# Altium schematic sheet Deck.SchDoc: TOF_Deck
size A4; Author: Iman Ostovar; CompanyName: ETH Zürich; DrawnBy: Iman Ostovar; Engineer: Iman Ostovar; Organization: PBL; DocumentNumber: Master Project; Revision: A; SheetNumber: 1; SheetTotal: 1
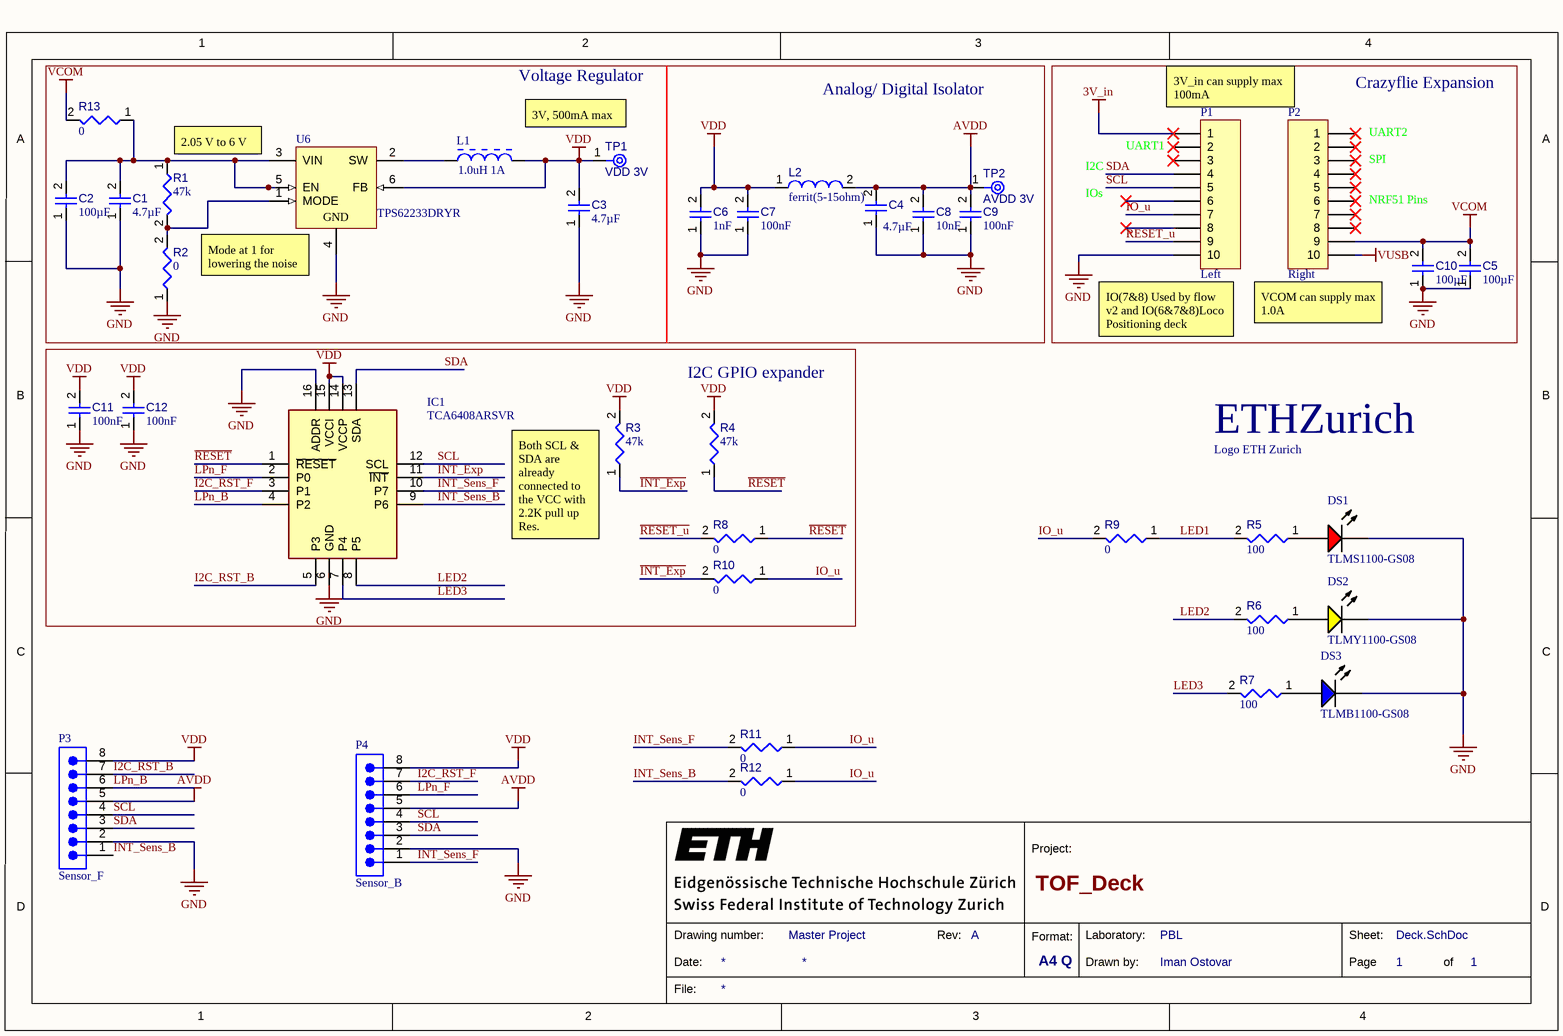
[diagram p0: Deck.SchDoc]

## Parts
A1  Logo ETH Zurich  [eth-zurich_3mm]  (no BOM)
C1  value 4.7µF  [CAPC1005X55X25ML5T10]  (hidden comment: Capacitor 1 uF +/- 10% 6.3 V 1005)
C2  value 100µF  [CAPC0805(2012)145_L]  (hidden comment: Capacitor 100µF +/-20% 6.3V 0805)
C3  value 4.7µF  [CAPC1005X55X25ML5T10]  (hidden comment: Capacitor 1 uF +/- 10% 6.3 V 1005)
C4  value 4.7µF  [CAPC1005X55X25ML5T10]  (hidden comment: Capacitor 1 uF +/- 10% 6.3 V 1005)
C5  value 100µF  [CAPC0805(2012)145_L]  (hidden comment: Capacitor 100µF +/-20% 6.3V 0805)
C6  value 1nF  [CAPC0402(1005)60_L]  (hidden comment: Capacitor 100nF +/-20% 25V 0402)
C7  value 100nF  [CAPC0402(1005)60_L]  (hidden comment: Capacitor 100nF +/-20% 25V 0402)
C8  value 10nF  [CAPC0402(1005)60_L]  (hidden comment: Capacitor 100nF +/-20% 25V 0402)
C9  value 100nF  [CAPC0402(1005)60_L]  (hidden comment: Capacitor 100nF +/-20% 25V 0402)
C10  value 100µF  [CAPC0805(2012)145_L]  (hidden comment: Capacitor 100µF +/-20% 6.3V 0805)
C11  value 100nF  [CAPC0402(1005)60_L]  (hidden comment: Capacitor 100nF +/-20% 25V 0402)
C12  value 100nF  [CAPC0402(1005)60_L]  (hidden comment: Capacitor 100nF +/-20% 25V 0402)
DS1  TLMS1100-GS08  [VISH-TLMX1100_V]
DS2  TLMY1100-GS08  [VISH-TLMX1100-2_V]
DS3  TLMB1100-GS08  [VISH-TLMX1100-2_V]
IC1  TCA6408ARSVR  [QFN40P180X260X55-16N]
L1  1.0uH 1A  [INDC2013X105X50ML20T20]
L2  value ferrit(5-15ohm)  [MURA-LQP15MN3N6B02D-2_M]  (hidden comment: LQP15MN3N6B02D)
P1  Left  [PCBComponent_1]
P2  Right  [PCBComponent_1]
P3  Sensor_F  [M50-3930842]
P4  Sensor_B  [M50-3930842]
R1  value 47k  [RESC0402(1005)_L]  (hidden comment: Resistor 47K5 +/-1 % 0402 63 mW)
R2  value 0  [RESC0402(1005)_L]  (hidden comment: Jumper 0402)
R3  value 47k  [RESC0402(1005)_L]  (hidden comment: Resistor 47K5 +/-1 % 0402 63 mW)
R4  value 47k  [RESC0402(1005)_L]  (hidden comment: Resistor 47K5 +/-1 % 0402 63 mW)
R5  value 100  [RESC0402(1005)_L]  (hidden comment: Resistor 47K5 +/-1 % 0402 63 mW)
R6  value 100  [RESC0402(1005)_L]  (hidden comment: Resistor 47K5 +/-1 % 0402 63 mW)
R7  value 100  [RESC0402(1005)_L]  (hidden comment: Resistor 47K5 +/-1 % 0402 63 mW)
R8  value 0  [RESC0402(1005)_L]  (hidden comment: Jumper 0402)
R9  value 0  [RESC0402(1005)_L]  (hidden comment: Jumper 0402)
R10  value 0  [RESC0402(1005)_L]  (hidden comment: Jumper 0402)
R11  value 0  [RESC0402(1005)_L]  (hidden comment: Jumper 0402)
R12  value 0  [RESC0402(1005)_L]  (hidden comment: Jumper 0402)
R13  value 0  [RESC0402(1005)_L]  (hidden comment: Jumper 0402)
TP1  VDD 3V  [TP06R]  (no BOM)
TP2  AVDD 3V  [TP06R]  (no BOM)
U6  TPS62233DRYR  [DRY0006A]

## Blocks framed on the sheet
Crazyflie Expansion: C5 C10 P1 P2
I2C GPIO expander: C11 C12 IC1 R3 R4 R8 R10

## Nets
3V_in: P1.1
AVDD: C4.2 C8.2 C9.2 L2.2 P3.5 P4.5 TP2.1(TP)
GND: C1.1 C2.1 C3.1 C4.1 C5.1 C6.1 C7.1 C8.1 C9.1 C10.1 C11.1 C12.1 DS1.2(K) DS2.2(K) DS3.2(K) IC1.6(GND) IC1.16(ADDR) P1.10 P3.2 P4.2 R2.1 U6.4(GND)
VCOM: C5.2 C10.2 P2.9 R13.2
VDD: C3.2 C6.2 C7.2 C11.2 C12.2 IC1.14(VCCP) IC1.15(VCCI) L1.2 L2.1 P3.8 P4.8 R3.2 R4.2 TP1.1(TP) U6.6(FB)
VUSB: P2.10
~{INT_Exp}: IC1.11(~{INT}) R3.1 R10.2
~{RESET}: IC1.1(~{RESET}) R4.1 R8.1
~{RESET_u}: P1.9 R8.2
I2C_RST_B: IC1.5(P3) P3.7
I2C_RST_F: IC1.3(P1) P4.7
INT_Sens_B: IC1.9(P6) P3.1 R12.2
INT_Sens_F: IC1.10(P7) P4.1 R11.2
IO_u: P1.7 R9.2 R10.1 R11.1 R12.1
LED1: R5.2 R9.1
LED2: IC1.8(P5) R6.2
LED3: IC1.7(P4) R7.2
LPn_B: IC1.4(P2) P3.6
LPn_F: IC1.2(P0) P4.6
SCL: IC1.12(SCL) P1.5 P3.4 P4.4
SDA: IC1.13(SDA) P1.4 P3.3 P4.3
NetC1_2: C1.2 C2.2 R1.1 R13.1 U6.3(VIN) U6.5(EN)
NetDS1_1: DS1.1(A) R5.1
NetDS2_1: DS2.1(A) R6.1
NetDS3_1: DS3.1(A) R7.1
NetL1_1: L1.1 U6.2(SW)
NetR1_2: R1.2 R2.2 U6.1(MODE)

Not connected (* = marked no-connect by the designer): P1 2* 3* 6* 8*; P2 1* 2* 3* 4* 5* 6* 7* 8*

## Notes on the sheet
- Voltage Regulator
- Analog/ Digital Isolator
- 3V_in can supply max 100mA
- 2.05 V to 6 V
- 3V, 500mA max
- I2C
- (near P1) UART1
- (near P2) SPI
- (near P2) UART2
- IOs
- NRF51 Pins
- (near U6) Mode at 1 for lowering the noise
- (near P1) IO(7&8) Used by flow v2 and IO(6&7&8)Loco Positioning deck
- VCOM can supply max 1.0A
- (near R3) Both SCL & SDA are already connected to the VCC with 2.2K pull up Res.
- 1
- 2
- 3
- 4
- A
- B
- C
- Project:
- D
- Date:
- Drawing number:
- Rev:
- Format:
- A4 Q
- Drawn by:
- Laboratory:
- Page
- Sheet:
- of
- File:
- (in symbol CMP-00038-1) ETHZurich

## Library data of the parts
A1 = CMP-00038-1
C1 C3 C4 = CMP-001-00009-6: Chip Capacitor, 1 uF, +/- 10%, 6.3 V, 1005 (0402 Metric); Voltage Rating: 6.3V; Capacitor Type: Ceramic; Min Operating Temperature: -55°C; Case/Package: 0402; Tolerance: 10%; Mounting Technology: SM; Max Operating Temperature: 85°C; RoHS Compliant: True; Pins: 2
C2 C5 C10 = CMP-001-00054-4: Chip Capacitor, 100µF +/-20%, 6.3V, 0805, Thickness 1.45 mm; Tolerance: 10%; Min Operating Temperature: -55°C; Max Operating Temperature: 85°C; Pins: 2; Mounting Technology: SMT; Case/Package: 0805; Voltage Rating: 6.3V
C6-C9 C11 C12 = CMP-001-00065-4: Chip Capacitor, 100nF +/-20%, 25V, 0402, Thickness 0.6 mm; Tolerance: 10%; Max Operating Temperature: 85°C; Min Operating Temperature: -55°C; Pins: 2; Voltage Rating: 25V; Mounting Technology: SMT; Case/Package: 0402
DS1 = CMP-007-00030-2: Red Led, 20mA, 2.1 V, -40 to 100 degC, 2-Pin SMD (0603), RoHS, Tape and Reel; Manufacturer: Vishay Semiconductor; Viewing Angle: 160degrees; Forward Voltage: 2.1V; Lens Style: Clear; Power: 90mW; Luminous Intensity: 63mcd; Datasheet Version: Rev. 2.7, 03/2016; Package Quantity: 3000; Colour: Red; Package Description: 2-Pin Surface Mount Device, Body 1.6 x 0.8 mm; Datasheet URL: http://www.vishay.com/docs/83173/tlmb1100.pdf; Package Reference: TLMX1100; Max Operating Temperature: 100°C; Mounting Technology: SM; Packaging: TapeandReel; Case/Package: 0603; Illumination Colour: Red; Forward Current: 20mA; Manufacturer URL: http://www.vishay.com/; RoHS Compliant: True; Min Operating Temperature: -40°C; Nominal Vf: 2.1V; Pins: 2
DS2 = CMP-007-00031-2: Yellow LED, 20 mA, 2.1 V, -40 to 100 degC, 2-Pin SMD (0603), RoHS, Tape and Reel; Manufacturer: Vishay Semiconductor; Power: 90mW; Lens Style: Diffused; Nominal Vf: 2.1V; Forward Current: 20mA; Luminous Intensity: 80mcd; Viewing Angle: 160degrees; Manufacturer URL: http://www.vishay.com/; Package Reference: 0603; Packaging: TapeandReel; Case/Package: 0603; Datasheet Version: Rev. 2.7, 03/2016; Package Quantity: 3000; Forward Voltage: 2.1V; RoHS Compliant: True; Mounting Technology: SM; Datasheet URL: http://download.siliconexpert.com/pdfs/2016/8/7/12/43/26/667/vsh_/manual/379263299541529tlmb1100.pdf; Min Operating Temperature: -40°C; Pins: 2; Package Description: 2-Pin Surface Mount Device, Body 1.6 x 0.8 mm; Colour: Yellow; Max Operating Temperature: 100°C; Illumination Colour: Yellow
DS3 = CMP-007-00028-2: Blue LED, 10 mA, 3.9 V, -40 to 100 degC, 2-Pin SMD (0603), RoHS, Tape and Reel; Manufacturer: Vishay Semiconductor; Forward Voltage: 3.9V; Viewing Angle: 160degrees; Power: 68mW; Forward Current: 10mA; Lens Style: Diffused; Luminous Intensity: 5mcd; Case/Package: 0603; Datasheet URL: http://download.siliconexpert.com/pdfs/2016/8/7/12/43/26/667/vsh_/manual/379263299541529tlmb1100.pdf; Illumination Colour: Blue; Datasheet Version: Rev. 2.7, 03/2016; Manufacturer URL: http://www.vishay.com/; Package Reference: 0603; Min Operating Temperature: -40°C; Packaging: TapeandReel; RoHS Compliant: True; Nominal Vf: 3.9V; Mounting Technology: SM; Pins: 2; Package Description: 2-Pin Surface Mount Device, Body 1.6 x 0.8 mm; Colour: Blue; Package Quantity: 3000; Max Operating Temperature: 100°C
IC1 = TCA6408ARSVR: Integrated Circuit; Manufacturer_Name: Texas Instruments; Datasheet Link: http://www.ti.com/lit/gpn/tca6408a; Height: 0.55mm; Manufacturer_Part_Number: TCA6408ARSVR; Mouser Part Number: 595-TCA6408ARSVR; Mouser Price/Stock: https://www.mouser.co.uk/ProductDetail/Texas-Instruments/TCA6408ARSVR?qs=AFkNxQkJKAISZm6jGsM%252BSQ%3D%3D; Arrow Part Number: TCA6408ARSVR; Arrow Price/Stock: https://www.arrow.com/en/products/tca6408arsvr/texas-instruments?region=nac
L1 = CMP-006-00000-3: 1.0uH 1150mA; Manufacturer: Murata; Core Material: Ferrite; Current Rating: 1.5A; Impedance: 330Ohm; Resistance: 90mohm; Tolerance: 25%; Max Operating Temperature: 125°C; Case/Package: 0805; Mounting Technology: SM; Datasheet URL: http://psearch.en.murata.com/inductor/product/LQG15HS15NJ02_.pdf; Packaging: TapeandReel; Min Operating Temperature: -55°C; RoHS Compliant: True; Max Current Rating: 1.5A; Datasheet Version: Nov-11; Package Quantity: 4000; Package Reference: 0805; Package Description: 2-Pin Surface Mount Device, Body 2 x1.25 mm
L2 = CMP-006-00010-6: Inductor, 500 MHz, 500 mA, 5 Ohm, -40 to 85 degC, 01005 (0402 Metric),; Manufacturer: Murata; Core Material: Ferrite; Self Resonant Frequency: 6GHz; Current Rating: 170mA; Shielding: Unshielded; Q Factor: 13; Datasheet URL: http://download.siliconexpert.com/pdfs/2016/4/21/8/25/31/646/mrt_/manual/797549851250188lqp15mn3n6b0223.pdf; Datasheet Version: Apr-16; Case/Package: 0402; Mounting Technology: SM; Min Operating Temperature: -40°C; RoHS Compliant: True; Package Description: 2-Pin Surface Mount Device, Body 1 x 0.5 mm; Max Operating Temperature: 85°C; Package Quantity: 10000; Package Reference: 0402; Packaging: TapeandReel
P1 P2 = MHDR1X10: Header, 10-Pin; LatestRevisionDate: 17-Jul-2002; LatestRevisionNote: Re-released for DXP Platform.; Publisher: Altium Limited
P3 P4 = CMP-01380-1: Connector Header Through Hole, Right Angle 8 position 0.050" (1.27mm); Connector Type: Header,Male Pin; Current Rating: 1A; Number of Positions: 8; Fastening Type: Push,Pull; Insulation Material: Nylon; Contact Plating: Gold; Max Operating Temperature: 105°C; Packaging: Bulk; Termination: Solder; Mount: Through Hole; Number of Rows: 1; Insulation Color: Black; Contact Shape: Square; Min Operating Temperature: -40°C; Contact Material: Brass; Flammability Rating: UL94 V-0
R1 R3-R7 = CMP-009-00137-3: Chip Resistor, 47,5 kOhms, +/-1 %, 63 mW, -55 to 155 degC, 0402; Power: 63mW; Tolerance: 1%; Pins: 2; Case/Package: 0402; Min Operating Temperature: -55°C; Max Operating Temperature: 155°C
R2 R8-R12 = CMP-009-00148-3: Pins: 2; Max Operating Temperature: 155°C; Min Operating Temperature: -55°C; Case/Package: 0402
R13 = CMP-009-00148-3: Current sensing jumper OR Fuse; Pins: 2; Max Operating Temperature: 155°C; Min Operating Temperature: -55°C; Case/Package: 0402
TP1 TP2 = CMP-00028-00002-2: 0.6mm round; Pins: 1
U6 = CMP-0323-00281-3: Buck Step Down Regulator with 2.05 to 6 V Input and 3 V Output, -40 to 85 degC, 6-Pin SON (DRY), Green (RoHS & no Sb/Br); Manufacturer: Texas Instruments; Vin(Max)(V): 6; Synchronous Rectification: False; Regulated Outputs(#): 1; SubFamily: Step-Down Regulator; Rating: Catalog; Preset Vout(V): 3; Vin(Min)(V): 2.05; Iq(Typ)(mA): 0.022; Duty Cycle(Max)(%): 100; Switch Current Limit(Typ)(A): 0.84; Iout(Max)(A): 0.5; ComponentLink1URL: http://www.ti.com/general/docs/lit/getliterature.tsp?genericPartNumber=TPS62233&fileType=pdf; Eco-Plan: Green (RoHS & no Sb/Br); ComponentLink1Description: Datasheet; PackageDescription: 6-Pin Plastic Small Outline No-Lead, 1 x 1.45 x 0.6 mm Body, 0.5 mm Pitch; PartNumber: TPS62233DRYR; Topology: Buck; Vout(Min)(V): 3; ComponentLink2Description: Package Specification; DatasheetVersion: SLVS941E; ComponentLink3URL: Samples URL:http://www.ti.com/product/tps62233#samples; Vout(Max)(V): 3; ComponentLink2URL: http://www.ti.com/litv/pdf/mpds221e; PackageVersion: revF, Dec-2011; ComponentLink3Description: URL Link1; PackageReference: DRY0006A; Mounting Technology: Surface Mount